# Altium project DKDongco.PrjPcb
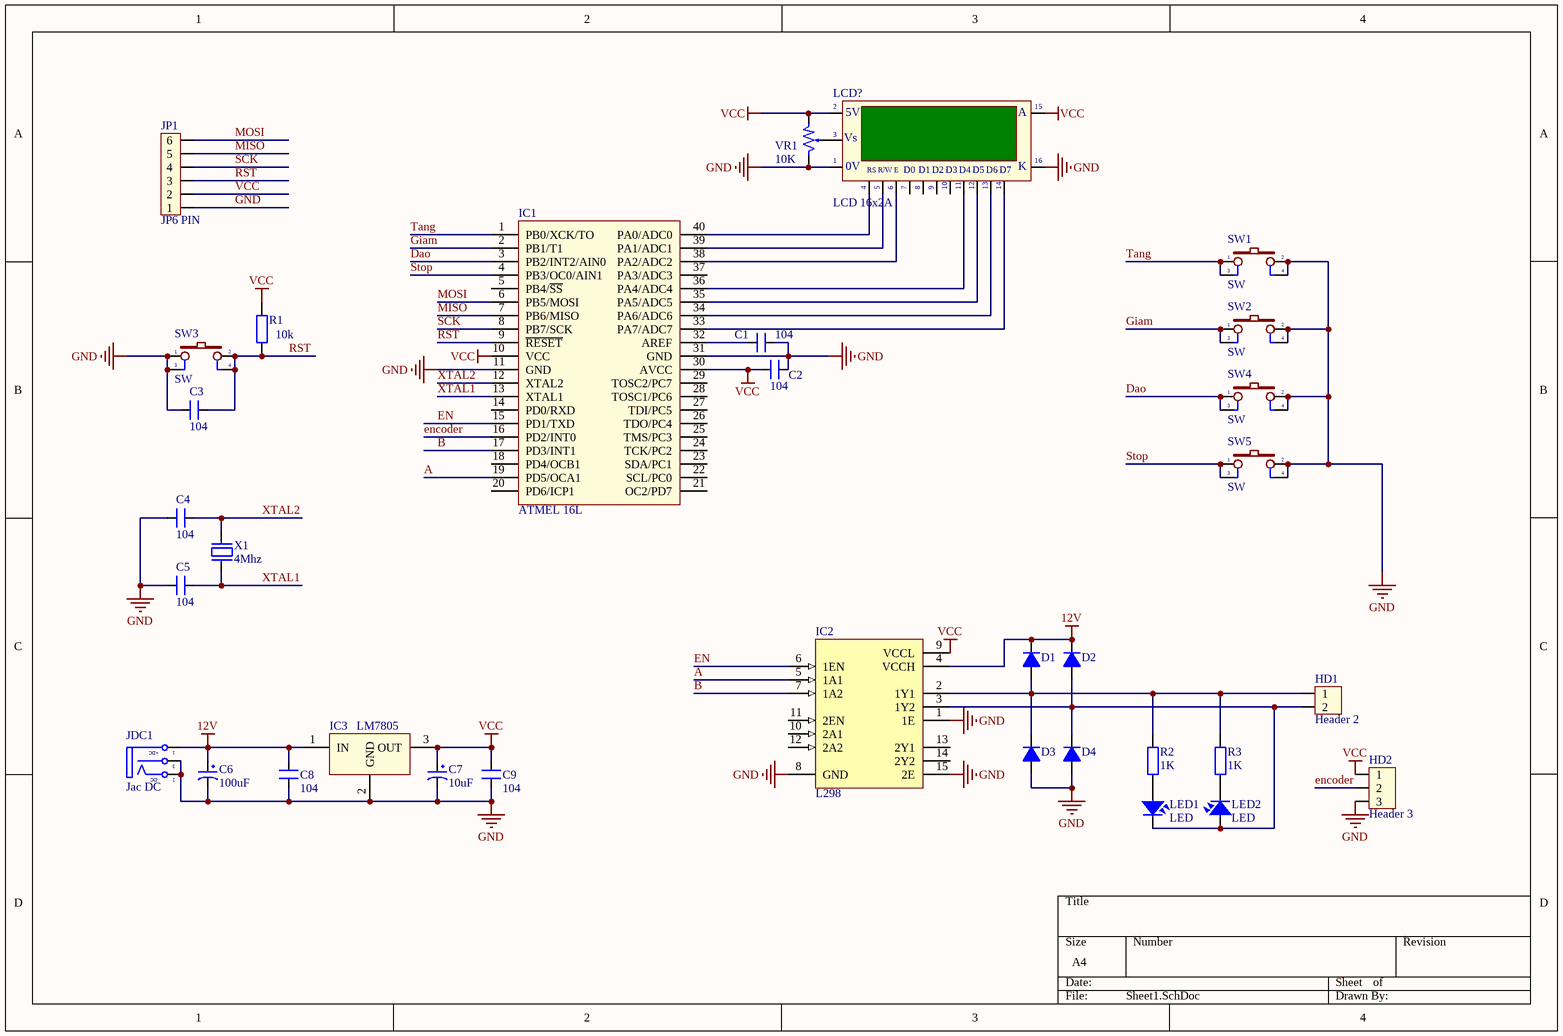
[diagram p0: Sheet1.SchDoc]
1 sheet, 33 parts. Net scope: global (net labels, ports and power ports of the same name join across sheets).
Board file: PCB1.PcbDoc

## Sheet Sheet1.SchDoc
size A4

### Parts
C1  104  [SM-0805]
C2  104  [SM-0805]
C3  104  [SM-0805]
C4  104  [SM-0805]
C5  104  [SM-0805]
C6  100uF  [CP1/2.5]
C7  10uF  [CP1/2]
C8  104  [SM-0805]
C9  104  [SM-0805]
D1  (no value)  [D1A]
D2  (no value)  [D1A]
D3  (no value)  [D1A]
D4  (no value)  [D1A]
HD1  Header 2  [HED2]
HD2  Header 3  [HED3]
IC1  ATMEL 16L  [DIP40/W0.6]
IC2  L298  [DIP15SL2]
IC3  LM7805  [QTO-220]
JDC1  Jac DC  [DC-IN]
JP1  JP6 PIN  [JP6]
LCD?  LCD 16x2A  [JP16-C1T]
LED1  LED  [LED-3]
LED2  LED  [LED-3]
R1  10k  [SM-0805]
R2  1K  [SM-0805]
R3  1K  [SM-0805]
SW1  SW  [SW4B]
SW2  SW  [SW4B]
SW3  SW  [SW4B]
SW4  SW  [SW4B]
SW5  SW  [SW4B]
VR1  10K  [VR]
X1  4Mhz  [XT2]

### Nets
12V: C6.1 C8.2 D1.2(K) D2.2(K) IC2.4(VCCH) IC3.1(IN) JDC1.1(T)
GND: C1.1 C2.1 C3.2 C4.2 C5.2 C6.2 C7.2 C8.1 C9.1 D3.1(A) D4.1(A) HD2.3 IC1.11(GND) IC1.31(GND) IC2.1(1E) IC2.8(GND) IC2.15(2E) IC3.2(GND) JDC1.2(TN) JDC1.3(S) JP1.1 LCD?.1(GND) LCD?.16(K) SW1.2 SW1.4 SW2.2 SW2.4 SW3.1 SW3.3 SW4.2 SW4.4 SW5.2 SW5.4 VR1.3
VCC: C2.2 C7.1 C9.2 HD2.1 IC1.10(VCC) IC1.30(AVCC) IC2.9(VCCL) IC3.3(OUT) JP1.2 LCD?.2(VDD) LCD?.15(A) R1.2 VR1.1
A: IC1.19(PD5/OCA1) IC2.5(1A1)
B: IC1.17(PD3/INT1) IC2.7(1A2)
Dao: IC1.3(PB2/INT2/AIN0) SW4.1 SW4.3
EN: IC1.15(PD1/TXD) IC2.6(1EN)
encoder: HD2.2 IC1.16(PD2/INT0)
Giam: IC1.2(PB1/T1) SW2.1 SW2.3
MISO: IC1.7(PB6/MISO) JP1.5
MOSI: IC1.6(PB5/MOSI) JP1.6
RST: C3.1 IC1.9(~{RESET}) JP1.3 R1.1 SW3.2 SW3.4
SCK: IC1.8(PB7/SCK) JP1.4
Stop: IC1.4(PB3/OC0/AIN1) SW5.1 SW5.3
Tang: IC1.1(PB0/XCK/TO) SW1.1 SW1.3
XTAL1: C5.1 IC1.13(XTAL1) X1.1
XTAL2: C4.1 IC1.12(XTAL2) X1.2
NetC1_2: C1.2 IC1.32(AREF)
NetD1_1: D1.1(A) D3.2(K) HD1.1 IC2.2(1Y1) R2.2 R3.2
NetD2_1: D2.1(A) D4.2(K) HD1.2 IC2.3(1Y2) LED1.2 LED2.1
NetIC1_33: IC1.33(PA7/ADC7) LCD?.14(D7)
NetIC1_34: IC1.34(PA6/ADC6) LCD?.13(D6)
NetIC1_35: IC1.35(PA5/ADC5) LCD?.12(D5)
NetIC1_36: IC1.36(PA4/ADC4) LCD?.11(D4)
NetIC1_38: IC1.38(PA2/ADC2) LCD?.6(~{EN})
NetIC1_39: IC1.39(PA1/ADC1) LCD?.5(R/~{W})
NetIC1_40: IC1.40(PA0/ADC0) LCD?.4(RS)
NetLCD?_3: LCD?.3(VEE) VR1.2
NetLED1_1: LED1.1 R2.1
NetLED2_2: LED2.2 R3.1

Not connected (* = marked no-connect by the designer): IC1 5(PB4/~{SS}) 14(PD0/RXD) 18(PD4/OCB1) 20(PD6/ICP1) 21(OC2/PD7) 22(SCL/PC0) 23(SDA/PC1) 24(TCK/PC2) 25(TMS/PC3) 26(TDO/PC4) 27(TDI/PC5) 28(TOSC1/PC6) 29(TOSC2/PC7) 37(PA3/ADC3); IC2 10(2A1) 11(2EN) 12(2A2) 13(2Y1) 14(2Y2); LCD? 7(D0) 8(D1) 9(D2) 10(D3)

### Notes on the sheet
- (in symbol DCIN) +DC; -DC
- (in symbol LCD16x2A) 5V; Vs; |; 0V; R/W; E

### Library data of the parts
C1-C5 C8 C9 = CM: Cap SMD; Value: 103
C6 = CP2: C 47uF/50V , 220uF/16V; Value: 47uF/16 - 50V; Description 1: 470uF/6,3V - 330uF/10V - 220uF/16V; Description 2: 100uF/25V - 35V - 47uF/50V - 22uF/100V; Description 3: 33uF => 47uF/63V - 1uF => 4,7uF/160V; Description 4: 1uF => 2,2uF/250V - 1uF/350V
C7 = CP1: Cap P  0,1uF < 22uF , 16 - 50V; Value: 10uF/50V; Description 1: 10 => 220uF/6,3V/10V - 10uF => 100uF/16V; Description 2: 0,1uF => 33uF/50V - 10uF => 22uF/63V; Description 3: 0,47uF => 10uF/100V
D1-D4 = D1A: Diode 1A; Value: 1N4007
HD1 = Hed2: Connecter 2 (Green); Value: Header 2
HD2 = Hed3: Header 3 (Green); Value: Header 3
IC1 = Atmega16L: 8-Bit AVR Microcontroller with 16K Bytes of In-System Programmable Flash Memory; Value: Atmega 16L
IC2 = L298: Dual Full-H Driver; Note: The tab is elec is connected to GND pin; Published: 15-May-2002; DatasheetVersion: Jun-1990; PackageReference: KV015; Publisher: Altium Limited; PackageDescription: TO, Thru-Hole, Vertical, Heatsink Mounted; 15 Bent Staggered Leads; Pitch 1.27 mm; ComponentLink1Description: Manufacturer Link; ComponentLink1URL: http://www.ti.com/
IC3 = LM78xx: On ap +, from + 5 to + 24VDC; Value: LM7805
JDC1 = DCIN: Jac DC input; Value: Jac DC
JP1 = JP6: Value: JP7
LCD? = LCD16x2A: LCD dipslay 16 char, 2 line; Value: LCD16x2A
LED1 LED2 = LED: LED Single colour Green and Red; Value: LED 3 ly Single Colour
R1 = RM: Resistor SMD; Value: 1K
R2 R3 = RM: Resistor SMD; Value: 1K
SW1-SW5 = SW4-1: Switch button 4 pin; Value: SW chip 4 pin
VR1 = VR1: Var Resistor; Value: VR 10K
X1 = XT2: Crystal For all Crystal 2pin.; Value: 4Mhz